# Altium schematic sheet Sheet1.SchDoc
size A4; SheetNumber: 1; SheetTotal: 1
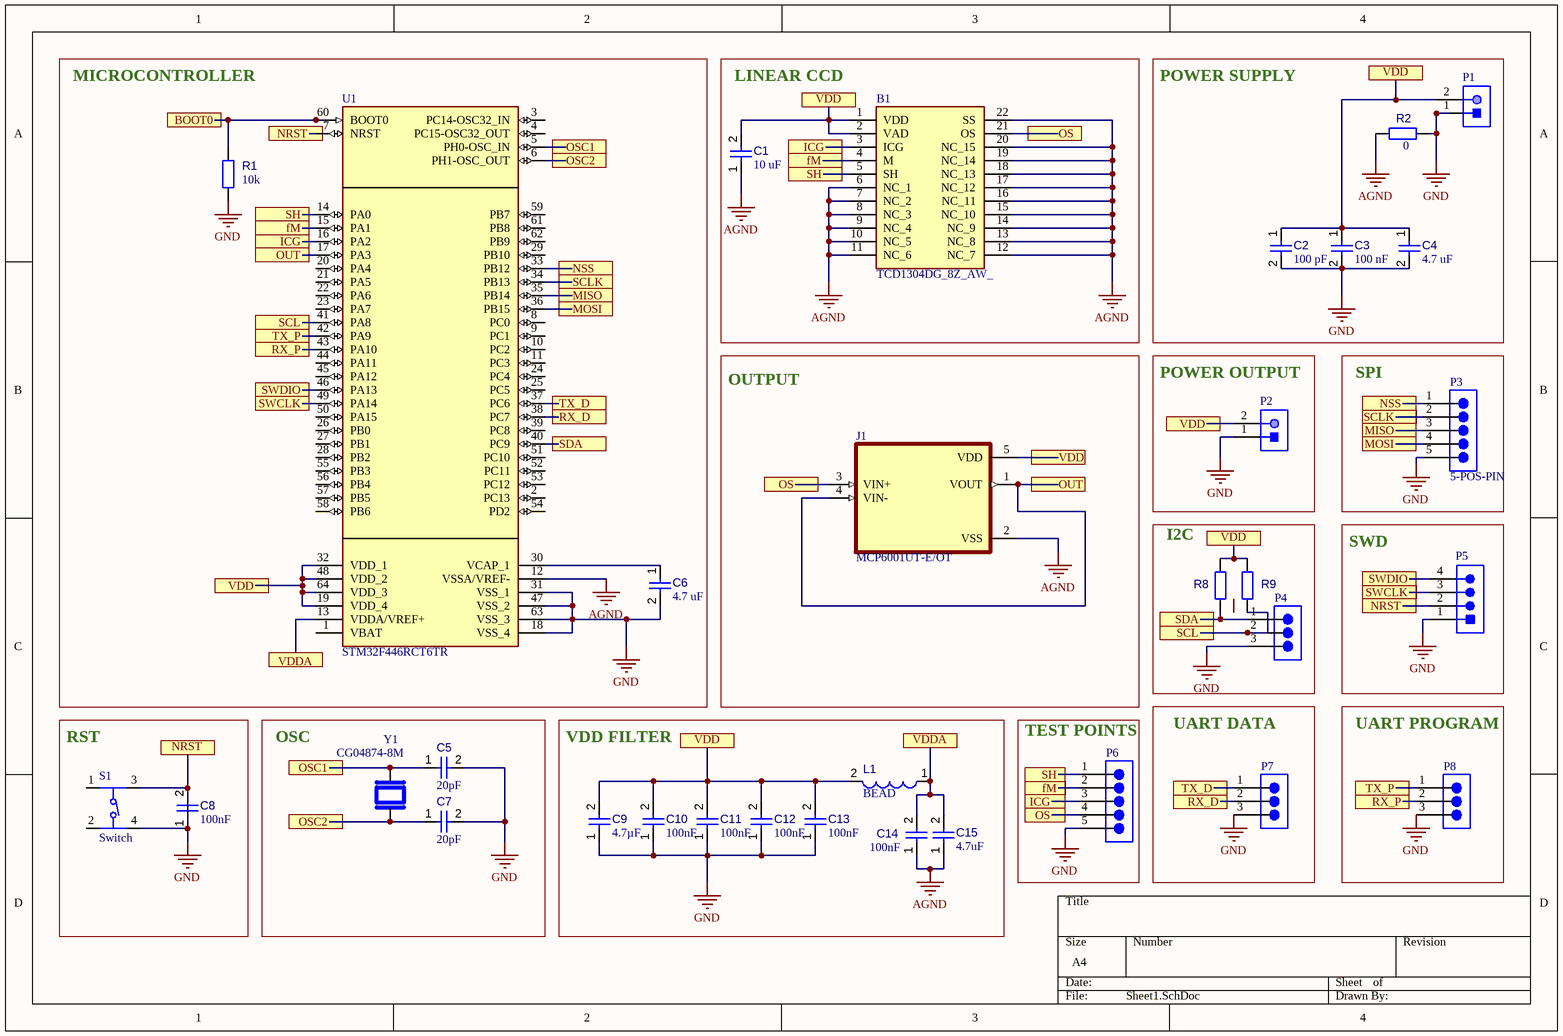
[diagram p0: Sheet1.SchDoc]

## Parts
B1  TCD1304DG_8Z_AW_  [DIP1016W62P254L4160H372Q22N]
C1  value 10 uF  [CAPC1005X56X25LL10T15]  (hidden comment: Capacitor 0.1 uF +/- 5% 16 V 0402)
C2  value 100 pF  [CAPC2013X95X50LL10T25]  (hidden comment: Capacitor 100 nF +/-10% 50 V 0805)
C3  value 100 nF  [CAPC2013X95X50LL10T25]  (hidden comment: Capacitor 100 nF +/-10% 50 V 0805)
C4  value 4.7 uF  [CAPC2013X95X50LL10T25]  (hidden comment: Capacitor 100 nF +/-10% 50 V 0805)
C5  value 20pF  [CAPC1005X56X25ML10T15]  (hidden comment: Capacitor 0.5 pF +/- 0.1pF 25 V 0402)
C6  value 4.7 uF  [CAPC2013X95X50LL10T25]  (hidden comment: Capacitor 100 nF +/-10% 50 V 0805)
C7  value 20pF  [CAPC1005X56X25ML10T15]  (hidden comment: Capacitor 0.5 pF +/- 0.1pF 25 V 0402)
C8  value 100nF  [CAPC1005X56X25LL10T15]  (hidden comment: Capacitor 0.1 uF +/- 5% 16 V 0402)
C9  value 4.7µF  [CAPC0603(1608)100_L]  (hidden comment: Capacitor 4.7µF +/-20% 10V 0603)
C10  value 100nF  [CAPC2013X95X50LL10T25]  (hidden comment: Capacitor 100 nF +/-10% 50 V 0805)
C11  value 100nF  [CAPC2013X95X50LL10T25]  (hidden comment: Capacitor 100 nF +/-10% 50 V 0805)
C12  value 100nF  [CAPC2013X95X50LL10T25]  (hidden comment: Capacitor 100 nF +/-10% 50 V 0805)
C13  value 100nF  [CAPC2013X95X50LL10T25]  (hidden comment: Capacitor 100 nF +/-10% 50 V 0805)
C14  value 100nF  [CAPC2013X95X50LL10T25]  (hidden comment: Capacitor 100 nF +/-10% 50 V 0805)
C15  value 4.7uF  [CAPC2013X95X50LL10T25]  (hidden comment: Capacitor 100 nF +/-10% 50 V 0805)
J1  MCP6001UT-E/OT  [SOT95P280X145-5N]
L1  value BEAD  [WE-LQS 4018]  (hidden comment: 74404042330)
P1  (no value)  [JST-S2B-PH-K-S_V]
P2  (no value)  [JST-S2B-PH-K-S_V]
P3  5-POS-PIN  [PCB_5POS_PIN]
P4  (no value)  [PCB_3POS_PIN]
P5  (no value)  [JST-S4B-XH-A(LF)(SN)_V]
P6  (no value)  [PCB_5POS_PIN]
P7  (no value)  [PCB_3POS_PIN]
P8  (no value)  [PCB_3POS_PIN]
R1  value 10k  [RESC0402(1005)_L]  (hidden comment: 10KR2F)
R2  value 0  [RESC0402(1005)_L]  (hidden comment: 10KR2F)
R8  10KR2F  [RESC0402(1005)_L]  (value not drawn)
R9  10KR2F  [RESC0402(1005)_L]  (value not drawn)
S1  Switch  [430152070826 Switch]
U1  STM32F446RCT6TR  [QFP50P1200X1200X160-64N]
Y1  CG04874-8M  [XTALDFN320X250X100-2N]

## Blocks framed on the sheet
MICROCONTROLLER: C6 R1 U1
LINEAR CCD: B1 C1
POWER SUPPLY: C2-C4 P1 R2
OUTPUT: J1
POWER OUTPUT: P2
SPI: P3
I2C: P4 R8 R9
SWD: P5
RST: C8 S1
OSC: C5 C7 Y1
VDD FILTER: C9-C15 L1
TEST POINTS: P6
UART DATA: P7
UART PROGRAM: P8

## Nets
AGND: B1.6(NC_1) B1.7(NC_2) B1.8(NC_3) B1.9(NC_4) B1.10(NC_5) B1.11(NC_6) B1.12(NC_7) B1.13(NC_8) B1.14(NC_9) B1.15(NC_10) B1.16(NC_11) B1.17(NC_12) B1.18(NC_13) B1.19(NC_14) B1.20(NC_15) B1.22(SS) C1.1 C14.1 C15.1 J1.2(VSS) R2.2 U1.12(VSSA/VREF-)
GND: C2.2 C3.2 C4.2 C5.2 C6.2 C7.2 C8.1 C9.1 C10.1 C11.1 C12.1 C13.1 P1.1 P2.1 P3.5 P4.3 P5.1 P6.5 P7.3 P8.3 R1.1 R2.1 S1.4 U1.18(VSS_4) U1.31(VSS_1) U1.47(VSS_2) U1.63(VSS_3)
BOOT0: R1.2 U1.60(BOOT0)
fM: B1.4(M) P6.2 U1.15(PA1)
ICG: B1.3(ICG) P6.3 U1.16(PA2)
MISO: P3.3 U1.35(PB14)
MOSI: P3.4 U1.36(PB15)
NRST: C8.2 P5.2 S1.3 U1.7(NRST)
NSS: P3.1 U1.33(PB12)
OS: B1.21(OS) J1.3(VIN+) P6.4
OSC1: C5.1 U1.5(PH0-OSC_IN) Y1.2
OSC2: C7.1 U1.6(PH1-OSC_OUT) Y1.1
OUT: J1.1(VOUT) J1.4(VIN-) U1.17(PA3)
RX_D: P7.2 U1.38(PC7)
RX_P: P8.2 U1.43(PA10)
SCL: P4.2 R9.2 U1.41(PA8)
SCLK: P3.2 U1.34(PB13)
SDA: P4.1 R8.2 U1.40(PC9)
SH: B1.5(SH) P6.1 U1.14(PA0)
SWCLK: P5.3 U1.49(PA14)
SWDIO: P5.4 U1.46(PA13)
TX_D: P7.1 U1.37(PC6)
TX_P: P8.1 U1.42(PA9)
VDD: B1.1(VDD) B1.2(VAD) C1.2 C2.1 C3.1 C4.1 C9.2 C10.2 C11.2 C12.2 C13.2 J1.5(VDD) L1.2 P1.2 P2.2 R8.1 R9.1 U1.19(VDD_4) U1.32(VDD_1) U1.48(VDD_2) U1.64(VDD_3)
VDDA: C14.2 C15.2 L1.1 U1.13(VDDA/VREF+)
NetC6_1: C6.1 U1.30(VCAP_1)

Not connected (* = marked no-connect by the designer): S1 1 2; U1 1(VBAT) 2(PC13) 3(PC14-OSC32_IN) 4(PC15-OSC32_OUT) 8(PC0) 9(PC1) 10(PC2) 11(PC3) 20(PA4) 21(PA5) 22(PA6) 23(PA7) 24(PC4) 25(PC5) 26(PB0) 27(PB1) 28(PB2) 29(PB10) 39(PC8) 44(PA11) 45(PA12) 50(PA15) 51(PC10) 52(PC11) 53(PC12) 54(PD2) 55(PB3) 56(PB4) 57(PB5) 58(PB6) 59(PB7) 61(PB8) 62(PB9)

## Library data of the parts
B1 = TCD1304DG_8Z_AW_: Image Sensors & Color Sensors CCD Linear Sensor 3648 8x20 54mm; Manufacturer_Name: Toshiba; Manufacturer_Part_Number: TCD1304DG(8Z,AW); Geometry.Height: 3.72mm; Mouser Part Number: 757-TCD1304DG8ZAW; Mouser Price/Stock: https://www.mouser.co.uk/ProductDetail/Toshiba/TCD1304DG8ZAW?qs=OLJpxlzHOSRVMcyirxbASw%3D%3D; Datasheet Link: https://datasheet.datasheetarchive.com/originals/distributors/DKDS-29/569259.pdf
C1 C8 = CMP-001-00001-6: Chip Capacitor, 0.1 uF, +/- 5%, 16 V, 0402 (1005 Metric); Capacitor Type: Ceramic; Voltage Rating: 16V; Max Operating Temperature: 125°C; Min Operating Temperature: -55°C; Case/Package: 0402; Mounting Technology: SM; Pins: 2; Tolerance: 5%; RoHS Compliant: True
C2-C4 C6 C10-C15 = CMP-001-00018-6: Chip Capacitor, 100 nF, +/- 10%, 50 V, 0805 (2012 Metric); Capacitor Type: Ceramic; Voltage Rating: 50V; Pins: 2; Max Operating Temperature: 125°C; Min Operating Temperature: -55°C; Mounting Technology: SM; Case/Package: 0805; RoHS Compliant: True; Tolerance: 10%
C5 C7 = CMP-001-00002-6: Chip Capacitor, 0.5 pF, +/- 0.1pF, 25 V, 0402 (1005 Metric); Voltage Rating: 25V; Tolerance: 20%; Capacitor Type: Ceramic; Max Operating Temperature: 125°C; Case/Package: 0402; Pins: 2; RoHS Compliant: True; Min Operating Temperature: -55°C; Mounting Technology: SM
C9 = CMP-001-00076-4: Chip Capacitor, 4.7µF +/-20%, 10V, 0603, Thickness 1 mm; Tolerance: 10%; Mounting Technology: SMT; Case/Package: 0603; Pins: 2; Min Operating Temperature: -55°C; Max Operating Temperature: 85°C; Voltage Rating: 10V
J1 = MCP6001UT-E/OT: Microchip MCP6001UT-E/OT Op Amp, 1MHz Rail-Rail, 1.8 - 6 V, 5-Pin SOT-23 | Microchip Technology Inc. MCP6001UT-E/OT; SnapEDA_Link: https://www.snapeda.com/parts/MCP6001UT-E/OT/Microchip/view-part/?ref=snap; Package: SOT-23 Microchip; Value: *; MF: Microchip; MP: MCP6001UT-E/OT; Check_prices: https://www.snapeda.com/parts/MCP6001UT-E/OT/Microchip/view-part/?ref=eda
L1 = CMP-006-00018-3: WE-LQS SMD Power Inductor, L=33 µH; Tolerance: 20%; ComponentLink2URL: http://katalog.we-online.de/pbs/datasheet/74404042330.pdf; ComponentLink1URL: http://www.we-online.com; ComponentLink2Description: Datasheet; Pins: 2; ComponentLink1Description: Manufacturer URL
P1 P2 = CMP-002-00030-2: Male Header, Pitch 2 mm, 1 x 2 Position, Height 4.8 mm, Tail Length 3.4 mm, -25 to 85 degC, RoHS, Bulk; Manufacturer: Japan Solderless Terminals; Package Reference: S2B-PH-K-S; Case/Package: S2B-PH-K-S; Datasheet URL: http://www.jst-mfg.com/product/pdf/eng/ePH.pdf; RoHS Compliant: Unknown; Datasheet Version: Dec-12; Gender: Male; Min Operating Temperature: -25°C; Max Operating Temperature: 85°C; Package Description: Male Header, Pitch 2 mm, 1 x 2 Position, Height 4.8 mm, Tail Length 3.4 mm; Connector Type: Header; Mounting Technology: SM
P4 P7 P8 = 3-POS-PIN
P5 = CMP-002-00034-2: Male Header, Pitch 2.5 mm, 1 x 4 Position, Height 6.1 mm, Tail Length 3.4 mm, -25 to 85 degC, RoHS, Bulk; Manufacturer: JST; Manufacturer URL: http://www.jst.com/home2.html; RoHS Compliant: Unknown; Gender: Male; Min Operating Temperature: -25°C; Datasheet URL: http://www.jst-mfg.com/product/pdf/eng/eXH.pdf; Case/Package: S4B-XH-A(LF)(SN); Datasheet Version: May-16; Mounting Technology: TH; Package Reference: S4B-XH-A(LF)(SN); Max Operating Temperature: 85°C; Package Description: XH Series Disconnectable Crimp Style Connector, Pitch 2.5 mm, 1 x 4 Position, Height 6.1 mm, Tail Length 3.4 mm; Connector Type: Header
P6 = 5-POS-PIN
R1 R2 R8 R9 = CMP-009-00066-2: 10K 0.063W 1% 0402 (1005 Metric)  SMD; Power: 63mW; Case/Package: 0402; Mounting Technology: SMT; Pins: 2; Tolerance: 1%
S1 = Switch: Tactile Switch SPST-NO Top Actuated Surface Mount; MF: WÃ¼rth Elektronik; MP: 430152070826; SnapEDA_Link: https://www.snapeda.com/parts/430152070826/W%25C3%25BCrth+Elektronik+Midcom/view-part/?ref=snap; Package: None; Value: *; Check_prices: https://www.snapeda.com/parts/430152070826/W%25C3%25BCrth+Elektronik+Midcom/view-part/?ref=eda
U1 = STM32F446RCT6TR: ARM Cortex-M4 STM32F4 Microcontroller IC 32-Bit Single-Core 180MHz 256KB (256K x 8) FLASH 64-LQFP (10x10); MF: STMicroelectronics; SnapEDA_Link: https://www.snapeda.com/parts/STM32F446RCT6TR/STMicroelectronics/view-part/?ref=snap; Package: LQFP-64 STMicroelectronics; Value: *; MP: STM32F446RCT6TR; Check_prices: https://www.snapeda.com/parts/STM32F446RCT6TR/STMicroelectronics/view-part/?ref=eda
Y1 = CG04874-8M: 8 MHz ±20ppm Crystal 8pF 500 Ohms 2-SMD, No Lead; MF: NDK America, Inc.; SnapEDA_Link: https://www.snapeda.com/parts/CG04874-8M/NDK+America%252C+Inc./view-part/?ref=snap; Package: SMD-2 NDK America,; Value: *; MP: CG04874-8M; Check_prices: https://www.snapeda.com/parts/CG04874-8M/NDK+America%252C+Inc./view-part/?ref=eda